# Altium schematic sheet Battery Management System.SchDoc
size A; SheetNumber: 5; SheetTotal: 9
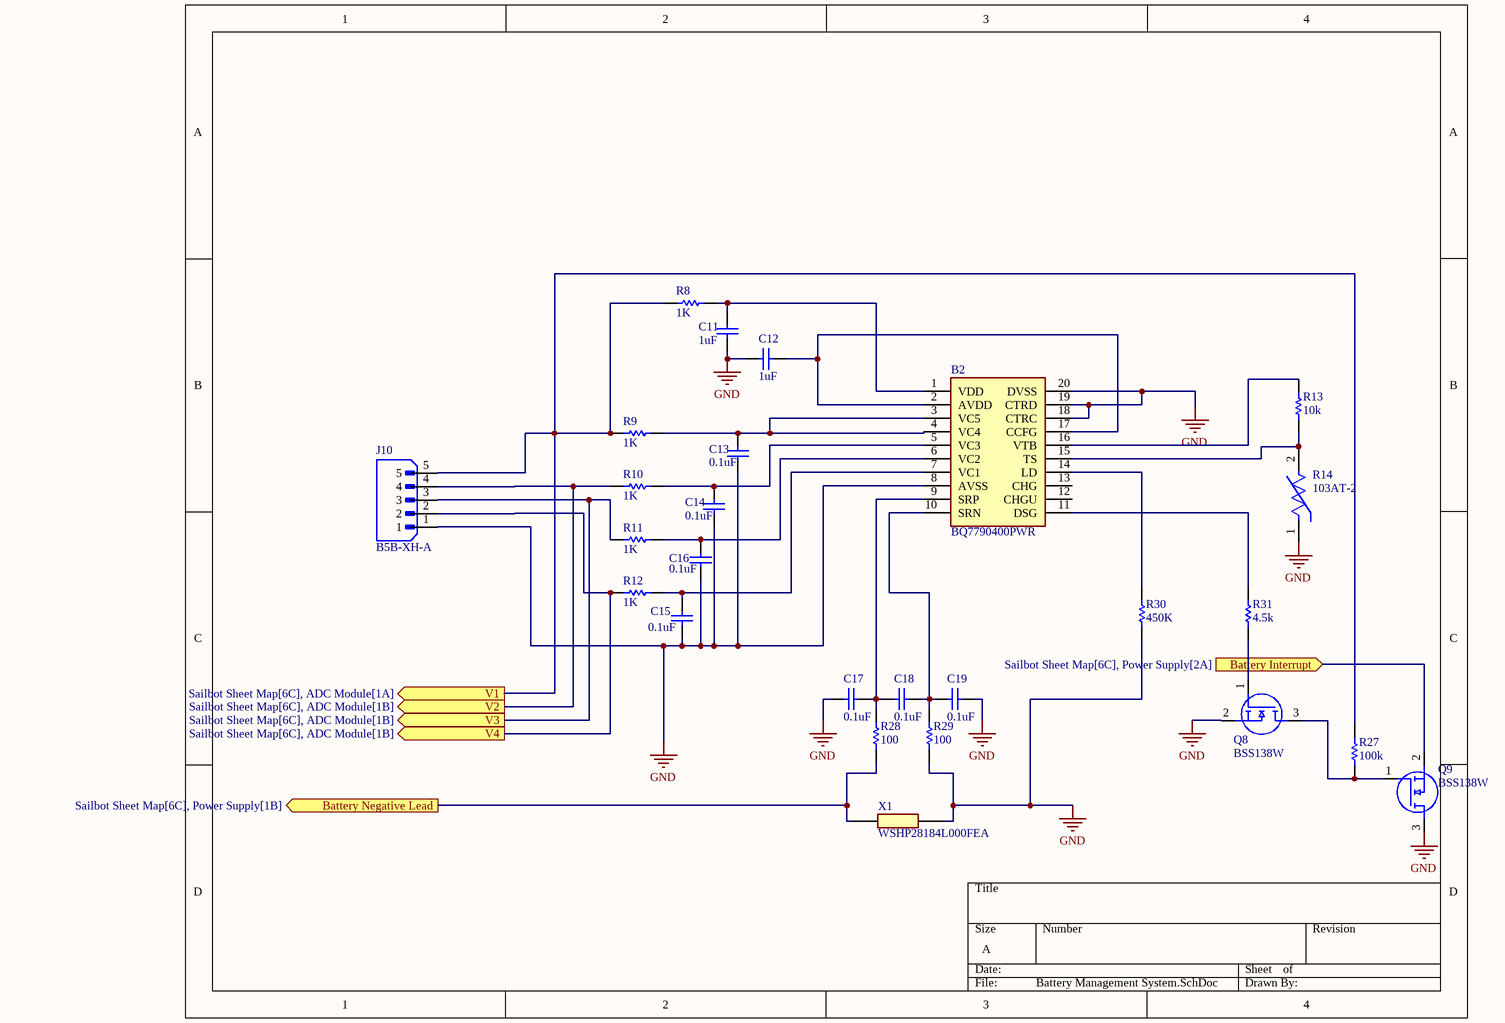
[diagram p0: Battery Management System.SchDoc]

## Parts
B2  BQ7790400PWR  [SOP65P640X120-20N]
C11  value 1uF  [C0805]  (hidden comment: Capacitor)
C12  value 1uF  [C0805]  (hidden comment: Capacitor)
C13  value 0.1uF  [C0805]  (hidden comment: Capacitor)
C14  value 0.1uF  [C0805]  (hidden comment: Capacitor)
C15  value 0.1uF  [C0805]  (hidden comment: Capacitor)
C16  value 0.1uF  [C0805]  (hidden comment: Capacitor)
C17  value 0.1uF  [C0805]  (hidden comment: Capacitor)
C18  value 0.1uF  [C0805]  (hidden comment: Capacitor)
C19  value 0.1uF  [C0805]  (hidden comment: Capacitor)
J10  B5B-XH-A  [JST_B5B-XH-A]
Q8  BSS138W  [SOT65P210X110-3N]
Q9  BSS138W  [SOT65P210X110-3N]
R8  value 1K  [6-0805_M]  (hidden comment: Resistor)
R9  value 1K  [6-0805_M]  (hidden comment: Resistor)
R10  value 1K  [6-0805_M]  (hidden comment: Resistor)
R11  value 1K  [6-0805_M]  (hidden comment: Resistor)
R12  value 1K  [6-0805_M]  (hidden comment: Resistor)
R13  value 10k  [6-0805_M]  (hidden comment: Resistor)
R14  103AT-2  [FP-103AT-2-MFG]
R27  value 100k  [6-0805_M]  (hidden comment: Resistor)
R28  value 100  [6-0805_M]  (hidden comment: Resistor)
R29  value 100  [6-0805_M]  (hidden comment: Resistor)
R30  value 450K  [6-0805_M]  (hidden comment: Resistor)
R31  value 4.5k  [6-0805_M]  (hidden comment: Resistor)
X1  WSHP28184L000FEA  [WSHP28184L000FEA]

## Ports
Battery Interrupt (in, see Sailbot Sheet Map[6C], Power Supply[2A]), Battery Negative Lead (out, see Sailbot Sheet Map[6C], Power Supply[1B]), V1 (out, see Sailbot Sheet Map[6C], ADC Module[1A]), V2 (out, see Sailbot Sheet Map[6C], ADC Module[1B]), V3 (out, see Sailbot Sheet Map[6C], ADC Module[1B]), V4 (out, see Sailbot Sheet Map[6C], ADC Module[1B])

## Nets
GND: B2.8(AVSS) B2.18(CTRC) B2.19(CTRD) B2.20(DVSS) C11.1 C12.2 C13.1 C14.1 C15.1 C16.1 C17.2 C19.1 J10.1 Q8.2(S) Q9.3(D) R14.1 R29.1 R30.1 X1.2
Battery Interrupt: Q9.2(S) ; port Battery Interrupt
Battery Negative Lead: R28.1 X1.1 ; port Battery Negative Lead
V1: J10.5 R8.1 R9.1 R27.2 ; port V1
V2: J10.4 R10.1 ; port V2
V3: J10.3 R11.1 ; port V3
V4: J10.2 R12.1 ; port V4
NetB2_1: B2.1(VDD) C11.2 R8.2
NetB2_2: B2.2(AVDD) B2.17(CCFG) C12.1
NetB2_3: B2.3(VC5) B2.4(VC4) C13.2 R9.2
NetB2_5: B2.5(VC3) C14.2 R10.2
NetB2_6: B2.6(VC2) C16.2 R11.2
NetB2_7: B2.7(VC1) C15.2 R12.2
NetB2_9: B2.9(SRP) C17.1 C18.2 R28.2
NetB2_10: B2.10(SRN) C18.1 C19.2 R29.2
NetB2_11: B2.11(DSG) R31.2
NetB2_14: B2.14(LD) R30.2
NetB2_15: B2.15(TS) R13.1 R14.2
NetB2_16: B2.16(VTB) R13.2
NetQ8_1: Q8.1(G) R31.1
NetQ8_3: Q8.3(D) Q9.1(G) R27.1

Not connected (* = marked no-connect by the designer): B2 12(CHGU) 13(CHG)

## Library data of the parts
B2 = BQ7790400PWR: 3-4S Low Power Protector; Manufacturer_Name: Texas Instruments; Geometry.Height: 1.2mm; Mouser Part Number: 595-BQ7790400PWR; Mouser Price/Stock: https://www.mouser.co.uk/ProductDetail/Texas-Instruments/BQ7790400PWR?qs=SMCV84mnLhnU0KDK1YzY%252Bw%3D%3D; Manufacturer_Part_Number: BQ7790400PWR; Datasheet Link: http://www.ti.com/lit/gpn/bq77904
C11-C19 = Capacitor: SimulationGenericComponent: True
J10 = B5B-XH-A: Connector Header Through Hole 5 position 0.098 (2.50mm); MF: JST Sales; SnapEDA_Link: https://www.snapeda.com/parts/B5B-XH-A/JST+Sales+America+Inc./view-part/?ref=snap; Package: None; Value: *; MP: B5B-XH-A; Check_prices: https://www.snapeda.com/parts/B5B-XH-A/JST+Sales+America+Inc./view-part/?ref=eda
Q8 Q9 = BSS138W: BSS138W N-Channel MOSFET, 210 mA, 50 V, 3-Pin SOT-323 ON Semiconductor; Manufacturer_Name: onsemi; Geometry.Height: 1.1mm; Mouser Part Number: 512-BSS138W; Mouser Price/Stock: https://www.mouser.co.uk/ProductDetail/onsemi-Fairchild/BSS138W?qs=iQhsftLtcNQX02h325QGXg%3D%3D; Manufacturer_Part_Number: BSS138W; Datasheet Link: https://www.onsemi.com/pub/Collateral/BSS138W-D.pdf
R8-R13 R27-R31 = Resistor: TC1: 0; SimulationGenericComponent: True; TC2: 0
R14 = CMP-2000-05824-2: Thermistor NTC 10KOhm 1% 2-Pin; Resistance: 10kR; Lead Pitch: 2.54mm; Height: 2.4mm; Max Operating Temperature: 110°C; Width: 3.7mm; RoHS Compliant: Yes; Min Operating Temperature: -50°C; Termination: Radial; Packaging: Bulk; Number of Pins: 2; Series: AT; Tolerance: 1%; Length: 17mm
X1 = WSHP28184L000FEA: Current Sense Resistors - SMD 10W .004ohms 1%; Manufacturer_Name: Vishay; Geometry.Height: 1.75mm; Mouser Part Number: 71-WSHP28184L000FEA; Mouser Price/Stock: https://www.mouser.co.uk/ProductDetail/Vishay-Dale/WSHP28184L000FEA?qs=WY0B%252Bpw29jP7%252BmGFaWxGvg%3D%3D; Manufacturer_Part_Number: WSHP28184L000FEA; Datasheet Link: https://www.vishay.com/doc?30347